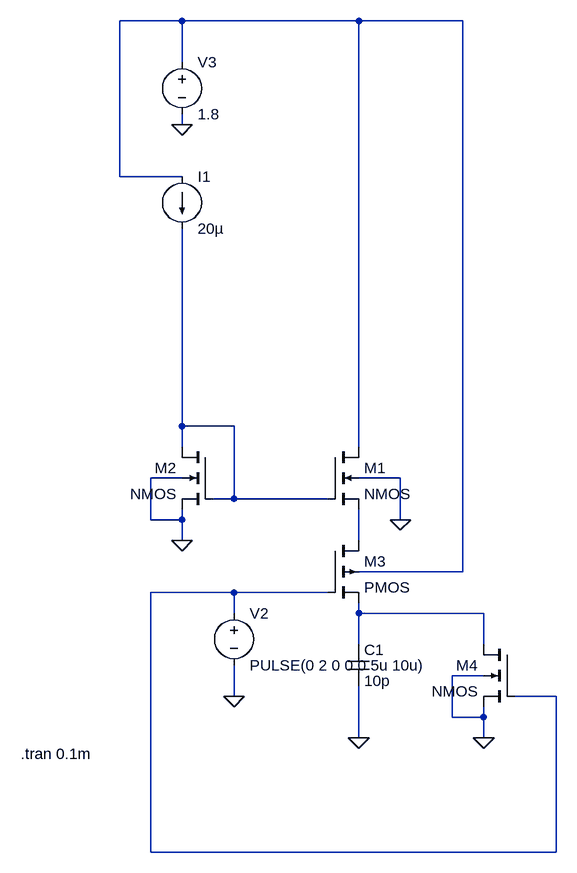
[diagram p0: schematic ramp_circuit.asc]
ramp_circuit.asc, the LTspice schematic file:
Version 4
SHEET 1 1124 804
WIRE 32 -480 -64 -480
WIRE 304 -480 32 -480
WIRE 464 -480 304 -480
WIRE 32 -416 32 -480
WIRE 32 -320 32 -336
WIRE -64 -240 -64 -480
WIRE 32 -240 -64 -240
WIRE 32 144 32 -160
WIRE 112 144 32 144
WIRE 32 176 32 144
WIRE 304 176 304 -480
WIRE 32 224 -16 224
WIRE 368 224 304 224
WIRE 112 256 112 144
WIRE 112 256 80 256
WIRE 256 256 112 256
WIRE -16 288 -16 224
WIRE 32 288 32 272
WIRE 32 288 -16 288
WIRE 368 288 368 224
WIRE 32 320 32 288
WIRE 304 320 304 272
WIRE 464 368 464 -480
WIRE 464 368 304 368
WIRE 112 400 -16 400
WIRE 256 400 112 400
WIRE 112 432 112 400
WIRE 304 432 304 416
WIRE 496 432 304 432
WIRE 304 480 304 432
WIRE 496 480 496 432
WIRE 496 528 448 528
WIRE 112 560 112 512
WIRE 608 560 544 560
WIRE 448 592 448 528
WIRE 496 592 496 576
WIRE 496 592 448 592
WIRE 304 624 304 544
WIRE 496 624 496 592
WIRE -16 800 -16 400
WIRE 608 800 608 560
WIRE 608 800 -16 800
FLAG 32 320 0
FLAG 304 624 0
FLAG 112 560 0
FLAG 368 288 0
FLAG 32 -320 0
FLAG 496 624 0
SYMBOL nmos4 256 176 R0
SYMATTR InstName M1
SYMATTR Value2 l=2u w=30u
SYMBOL nmos4 80 176 M0
SYMATTR InstName M2
SYMATTR Value2 l=2u w=20u
SYMBOL cap 288 480 R0
SYMATTR InstName C1
SYMATTR Value 10p
SYMBOL pmos4 256 320 R0
SYMATTR InstName M3
SYMATTR Value2 l=2u w=20u
SYMBOL voltage 112 416 R0
WINDOW 123 0 0 Left 2
WINDOW 39 0 0 Left 2
SYMATTR InstName V2
SYMATTR Value PULSE(0 2 0 0 0 5u 10u)
SYMBOL voltage 32 -432 R0
WINDOW 123 0 0 Left 2
WINDOW 39 0 0 Left 2
SYMATTR InstName V3
SYMATTR Value 1.8
SYMBOL current 32 -240 R0
WINDOW 123 0 0 Left 2
WINDOW 39 0 0 Left 2
SYMATTR InstName I1
SYMATTR Value 20µ
SYMBOL nmos4 544 480 M0
SYMATTR InstName M4
SYMATTR Value2 l=2u w=10u
TEXT -216 648 Left 2 !.tran 0.1m

The netlist it stands for:
* ramp_circuit.asc
M1 N001 N002 N003 0 NMOS l=2u w=30u
M2 N002 N002 0 0 NMOS l=2u w=20u
C1 N005 0 10p
M3 N003 N004 N005 N001 PMOS l=2u w=20u
V2 N004 0 PULSE(0 2 0 0 0 5u 10u)
V3 N001 0 1.8
I1 N001 N002 20µ
M4 N005 N004 0 0 NMOS l=2u w=10u
.model NMOS NMOS
.model PMOS PMOS
.lib standard.mos
.tran 0.1m
.backanno
.end